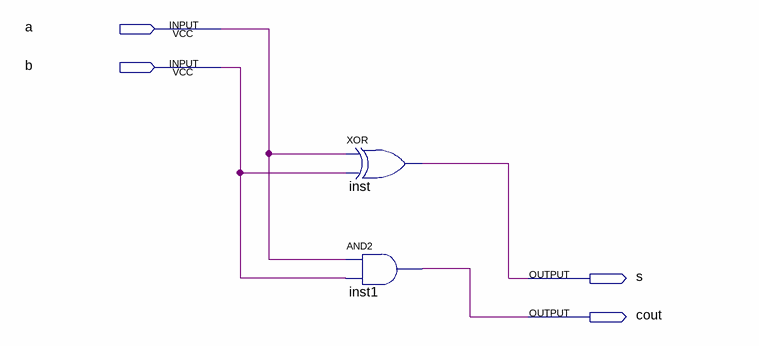
[diagram p0: schematic sheet]
// Quartus schematic ldm_meiosomador.bdf as structural Verilog: 2 symbols, 4 pins
module ldm_meiosomador (
  input  a,
  input  b,
  output s,
  output cout
);

  xor inst (s, a, b);
  and inst1 (cout, a, b);
endmodule
